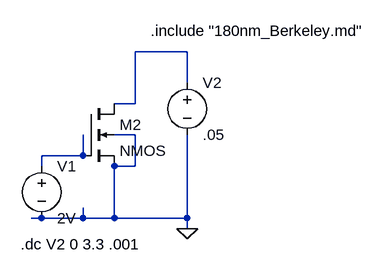
[diagram p0: schematic NMOS_Characteristics.asc]
NMOS_Characteristics.asc, the LTspice schematic file:
Version 4
SHEET 1 880 680
WIRE 320 16 240 16
WIRE 320 64 320 16
WIRE 240 96 240 16
WIRE 240 96 208 96
WIRE 240 144 208 144
WIRE 160 176 160 144
WIRE 160 176 96 176
WIRE 96 192 96 176
WIRE 240 192 240 144
WIRE 240 192 208 192
WIRE 96 272 80 272
WIRE 160 272 160 256
WIRE 160 272 96 272
WIRE 208 272 208 192
WIRE 208 272 160 272
WIRE 320 272 320 144
WIRE 320 272 208 272
WIRE 320 288 320 272
FLAG 320 288 0
SYMBOL voltage 96 176 R0
WINDOW 123 0 0 Left 2
WINDOW 39 0 0 Left 2
SYMATTR InstName V1
SYMATTR Value 2V
SYMBOL voltage 320 48 R0
WINDOW 123 0 0 Left 2
WINDOW 39 0 0 Left 2
SYMATTR InstName V2
SYMATTR Value .05
SYMBOL nmos4 160 96 R0
SYMATTR InstName M2
SYMATTR Value2 l=180n w=540n
TEXT 264 -16 Left 2 !.include "180nm_Berkeley.md"
TEXT 64 312 Left 2 !.dc V2 0 3.3 .001

The netlist it stands for:
* NMOS_Characteristics.asc
V1 N002 0 2V
V2 N001 0 .05
M2 N001 N002 0 0 NMOS l=180n w=540n
.model NMOS NMOS
.model PMOS PMOS
.lib standard.mos
.include "180nm_Berkeley.md"
.dc V2 0 3.3 .001
.backanno
.end